# EAGLE schematic radio_buck-boost (EAGLE 8.6.0)
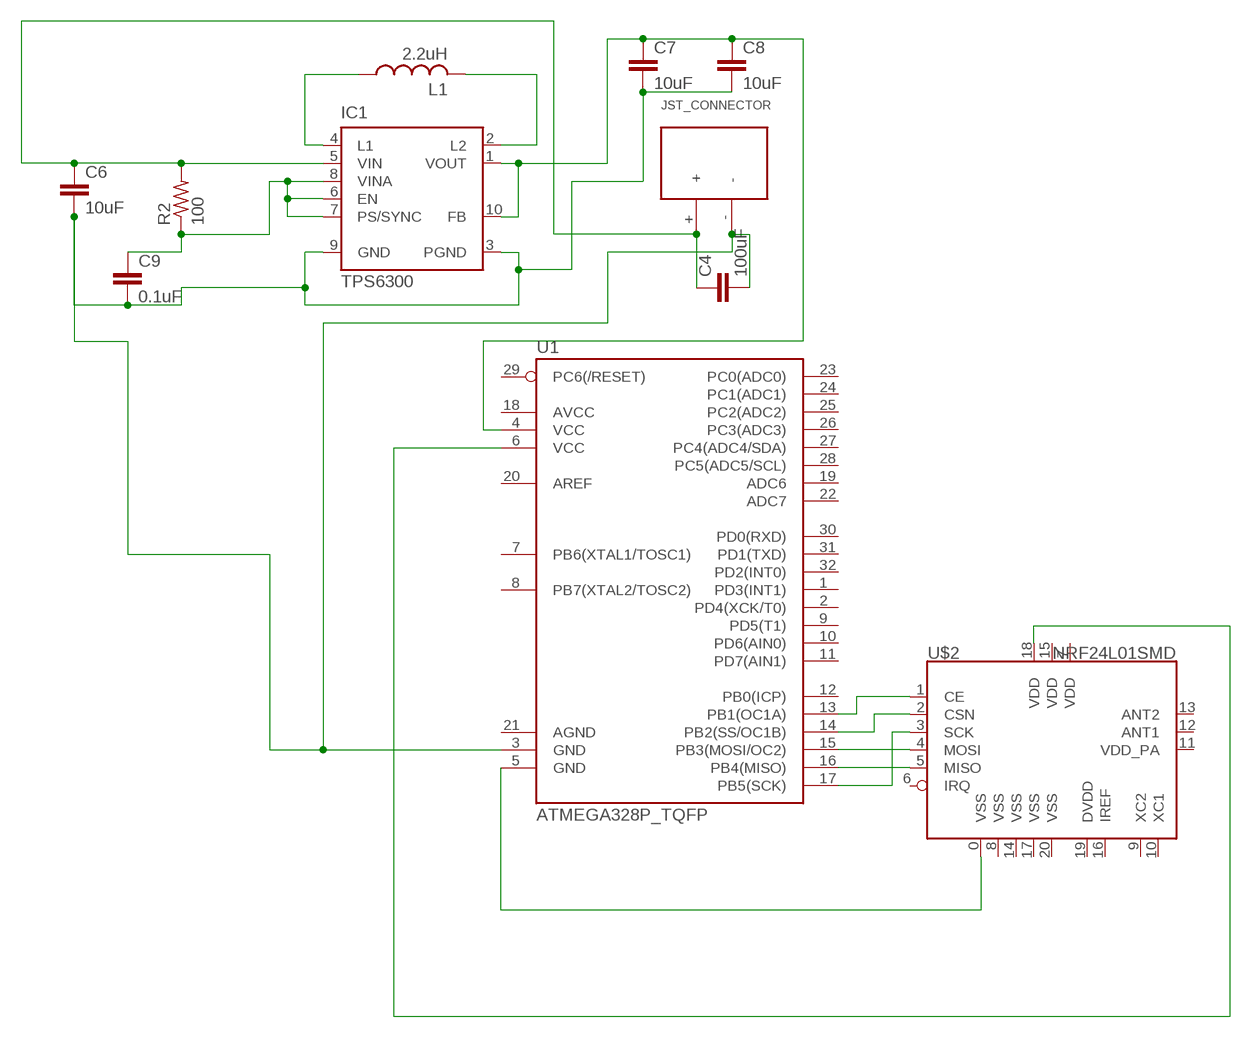
[diagram p0: schematic, sheet 1]

## Parts
C4  100uF  C-EUC2220K  [C2220K]
C6  10uF  C-EUC0603  [C0603]
C7  10uF  C-EUC0603  [C0603]
C8  10uF  C-EUC0603  [C0603]
C9  0.1uF  C-EUC0603  [C0603]
IC1  TPS6300  [DRC-S-PVSON-N10]
L1  2.2uH  L-US0204/5  [0204/5]
R2  100  R-US_R0603  [R0603]
U1  ATMEGA328P_TQFP  [TQFP32-08]
U$1  JST_CONNECTOR_FEMALE  [JST_CONNECTOR_FEMALE]
U$2  NRF24L01SMD  [QFN20-4X4MM]

## Nets
N$1: U1.6(VCC) U$2.18(VDD)
N$2: U1.5(GND) U$2.0(VSS)
N$3: U1.15(PB3(MOSI/OC2)) U$2.4(MOSI)
N$4: U1.16(PB4(MISO)) U$2.5(MISO)
N$5: U1.14(PB2(SS/OC1B)) U$2.2(CSN)
N$6: C4.1 C6.1 IC1.5(VIN) R2.2 U$1.+
N$8: U1.13(PB1(OC1A)) U$2.1(CE)
N$9: U1.17(PB5(SCK)) U$2.3(SCK)
N$10: C4.2 C6.2 C7.2 C8.2 C9.2 IC1.3(PGND) IC1.9(GND) U1.3(GND) U$1.-
N$23: IC1.4(L1) L1.1
N$24: IC1.2(L2) L1.2
N$25: C7.1 C8.1 IC1.1(VOUT) IC1.10(FB) U1.4(VCC)
N$28: C9.1 IC1.6(EN) IC1.7(PS/SYNC) IC1.8(VINA) R2.1
Unconnected: IC1.TH U1.1(PD3(INT1)) U1.2(PD4(XCK/T0)) U1.7(PB6(XTAL1/TOSC1)) U1.8(PB7(XTAL2/TOSC2)) U1.9(PD5(T1)) U1.10(PD6(AIN0)) U1.11(PD7(AIN1)) U1.12(PB0(ICP)) U1.18(AVCC) U1.19(ADC6) U1.20(AREF) U1.21(AGND) U1.22(ADC7) U1.23(PC0(ADC0)) U1.24(PC1(ADC1)) U1.25(PC2(ADC2)) U1.26(PC3(ADC3)) U1.27(PC4(ADC4/SDA)) U1.28(PC5(ADC5/SCL)) U1.29(PC6(/RESET)) U1.30(PD0(RXD)) U1.31(PD1(TXD)) U1.32(PD2(INT0)) U$2.6(IRQ) U$2.9(XC2) U$2.10(XC1) U$2.12(ANT1) U$2.13(ANT2) U$2.16(IREF)

## Power pins joined to a net without a drawn wire
DVDD: U$2.19(DVDD)
VDD: U$2.7(VDD) U$2.15(VDD)
VDD_PA: U$2.11(VDD_PA)
VSS: U$2.8(VSS) U$2.14(VSS) U$2.17(VSS) U$2.20(VSS)

## Library data of the parts
C4 C6-C9 = rcl:C-EU: CAPACITOR, European symbol; SPICEPREFIX: C
IC1 = texas:TPS6300*: HIGH EFFICIENT SINGLE INDUCTOR BUCK-BOOST CONVERTER WITH 1.8-A SWITCHES Source: http://focus.ti.com/lit/ds/symlink/tps63001.pdf; MPN: TPS63000DRCTG4; OC_FARNELL: 1511852; OC_NEWARK: 59M7217
L1 = rcl:L-US: INDUCTOR, American symbol; SPICEPREFIX: L
R2 = rcl:R-US_: RESISTOR, American symbol; SPICEPREFIX: R
U1 = quad:ATMEGA328P_TQFP; PROD_ID: IC-09069
U$1 = quad:JST_CONNECTOR_FEMALE
U$2 = SparkFun-RF:NRF24L01: Nordic nrf24L01 2.4GHz Low-power Transceiver This is the very popular, low cost, very low power RF transceiver from Nordic Semiconductor. Simple SPI interface. SparkFun Products 2.4GHz Transceiver IC - nRF24L01+ <https://www.sparkfun.com/products/690> (COM-00690) SparkFun Transceiver Breakout - nRF24L01+ (RP-SMA) <https://www.sparkfun.com/products/705> (WRL-00705) SparkFun Transceiver Breakout - nRF24L01+ <https://www.sparkfun.com/products/691> (COM-00691); PROD_ID: IC-08950; SF_ID: COM-00690